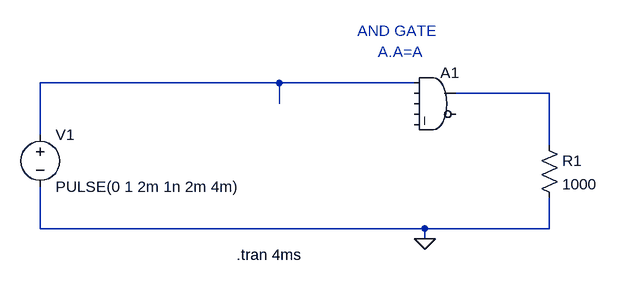
[diagram p0: schematic Draft6.asc]
Draft6.asc, the LTspice schematic file:
Version 4
SHEET 1 880 680
WIRE 160 64 -208 64
WIRE 368 64 160 64
WIRE 576 80 432 80
WIRE 160 96 160 64
WIRE -208 144 -208 64
WIRE 576 160 576 80
WIRE -208 288 -208 224
WIRE 384 288 -208 288
WIRE 576 288 576 240
WIRE 576 288 384 288
WIRE 384 304 384 288
FLAG 384 304 0
SYMBOL voltage -208 128 R0
WINDOW 123 0 0 Left 0
WINDOW 39 0 0 Left 0
SYMATTR InstName V1
SYMATTR Value PULSE(0 1 2m 1n 2m 4m)
SYMBOL res 560 144 R0
SYMATTR InstName R1
SYMATTR Value 1000
SYMBOL Digital\\and 400 32 R0
SYMATTR InstName A1
TEXT 280 -16 Left 2 ;AND GATE
TEXT 94 328 Left 2 !.tran 4ms
TEXT 312 16 Left 2 ;A.A=A

The netlist it stands for:
* Draft6.asc
V1 N001 0 PULSE(0 1 2m 1n 2m 4m)
R1 N002 0 1000
A1 N001 0 0 0 0 0 N002 0 AND
* AND GATE
.tran 4ms
* A.A=A
.backanno
.end